# EAGLE schematic ds3231 (EAGLE 6.3)
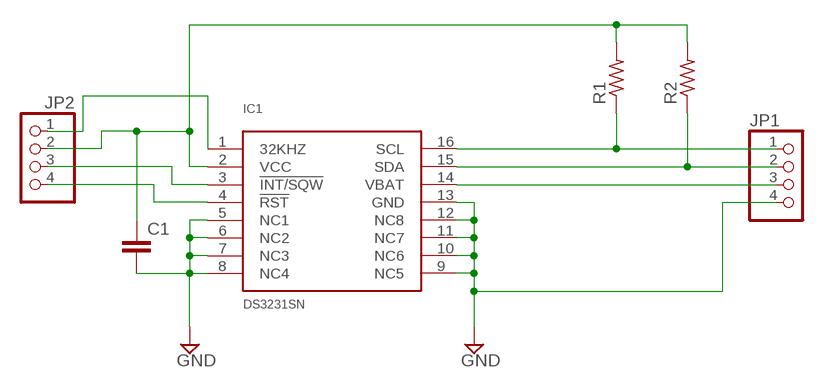
[diagram p0: schematic, sheet 1]

## Parts
C1  C5/3.5  [C5B3.5]
IC1  DS3231SN  [SO16W]
JP1  PINHD-1X4  [1X04]
JP2  PINHD-1X4  [1X04]
R1  R-US_0207/10  [0207/10]
R2  R-US_0207/10  [0207/10]

## Nets
GND: C1.2 IC1.5(NC1) IC1.6(NC2) IC1.7(NC3) IC1.8(NC4) IC1.9(NC5) IC1.10(NC6) IC1.11(NC7) IC1.12(NC8) IC1.13(GND) JP1.4
N$1: C1.1 IC1.2(VCC) JP2.2 R1.2 R2.2
N$2: IC1.1(32KHZ) JP2.1
N$3: IC1.14(VBAT) JP1.3
N$4: IC1.4(!RST) JP2.4
N$5: IC1.3(!INT/SQW) JP2.3
N$7: IC1.15(SDA) JP1.2 R2.1
R1: IC1.16(SCL) JP1.1 R1.1

## Library data of the parts
C1 = capacitor-wima:C: CAPACITOR naming: grid - package width
IC1 = comfile:DS3231SN
JP1 JP2 = pinhead:PINHD-1X4: PIN HEADER
R1 R2 = resistor:R-US_: RESISTOR, American symbol